# EAGLE design SCHEMATIC_R1 (EAGLE 9.6.2)

## Sheet 1 of 2
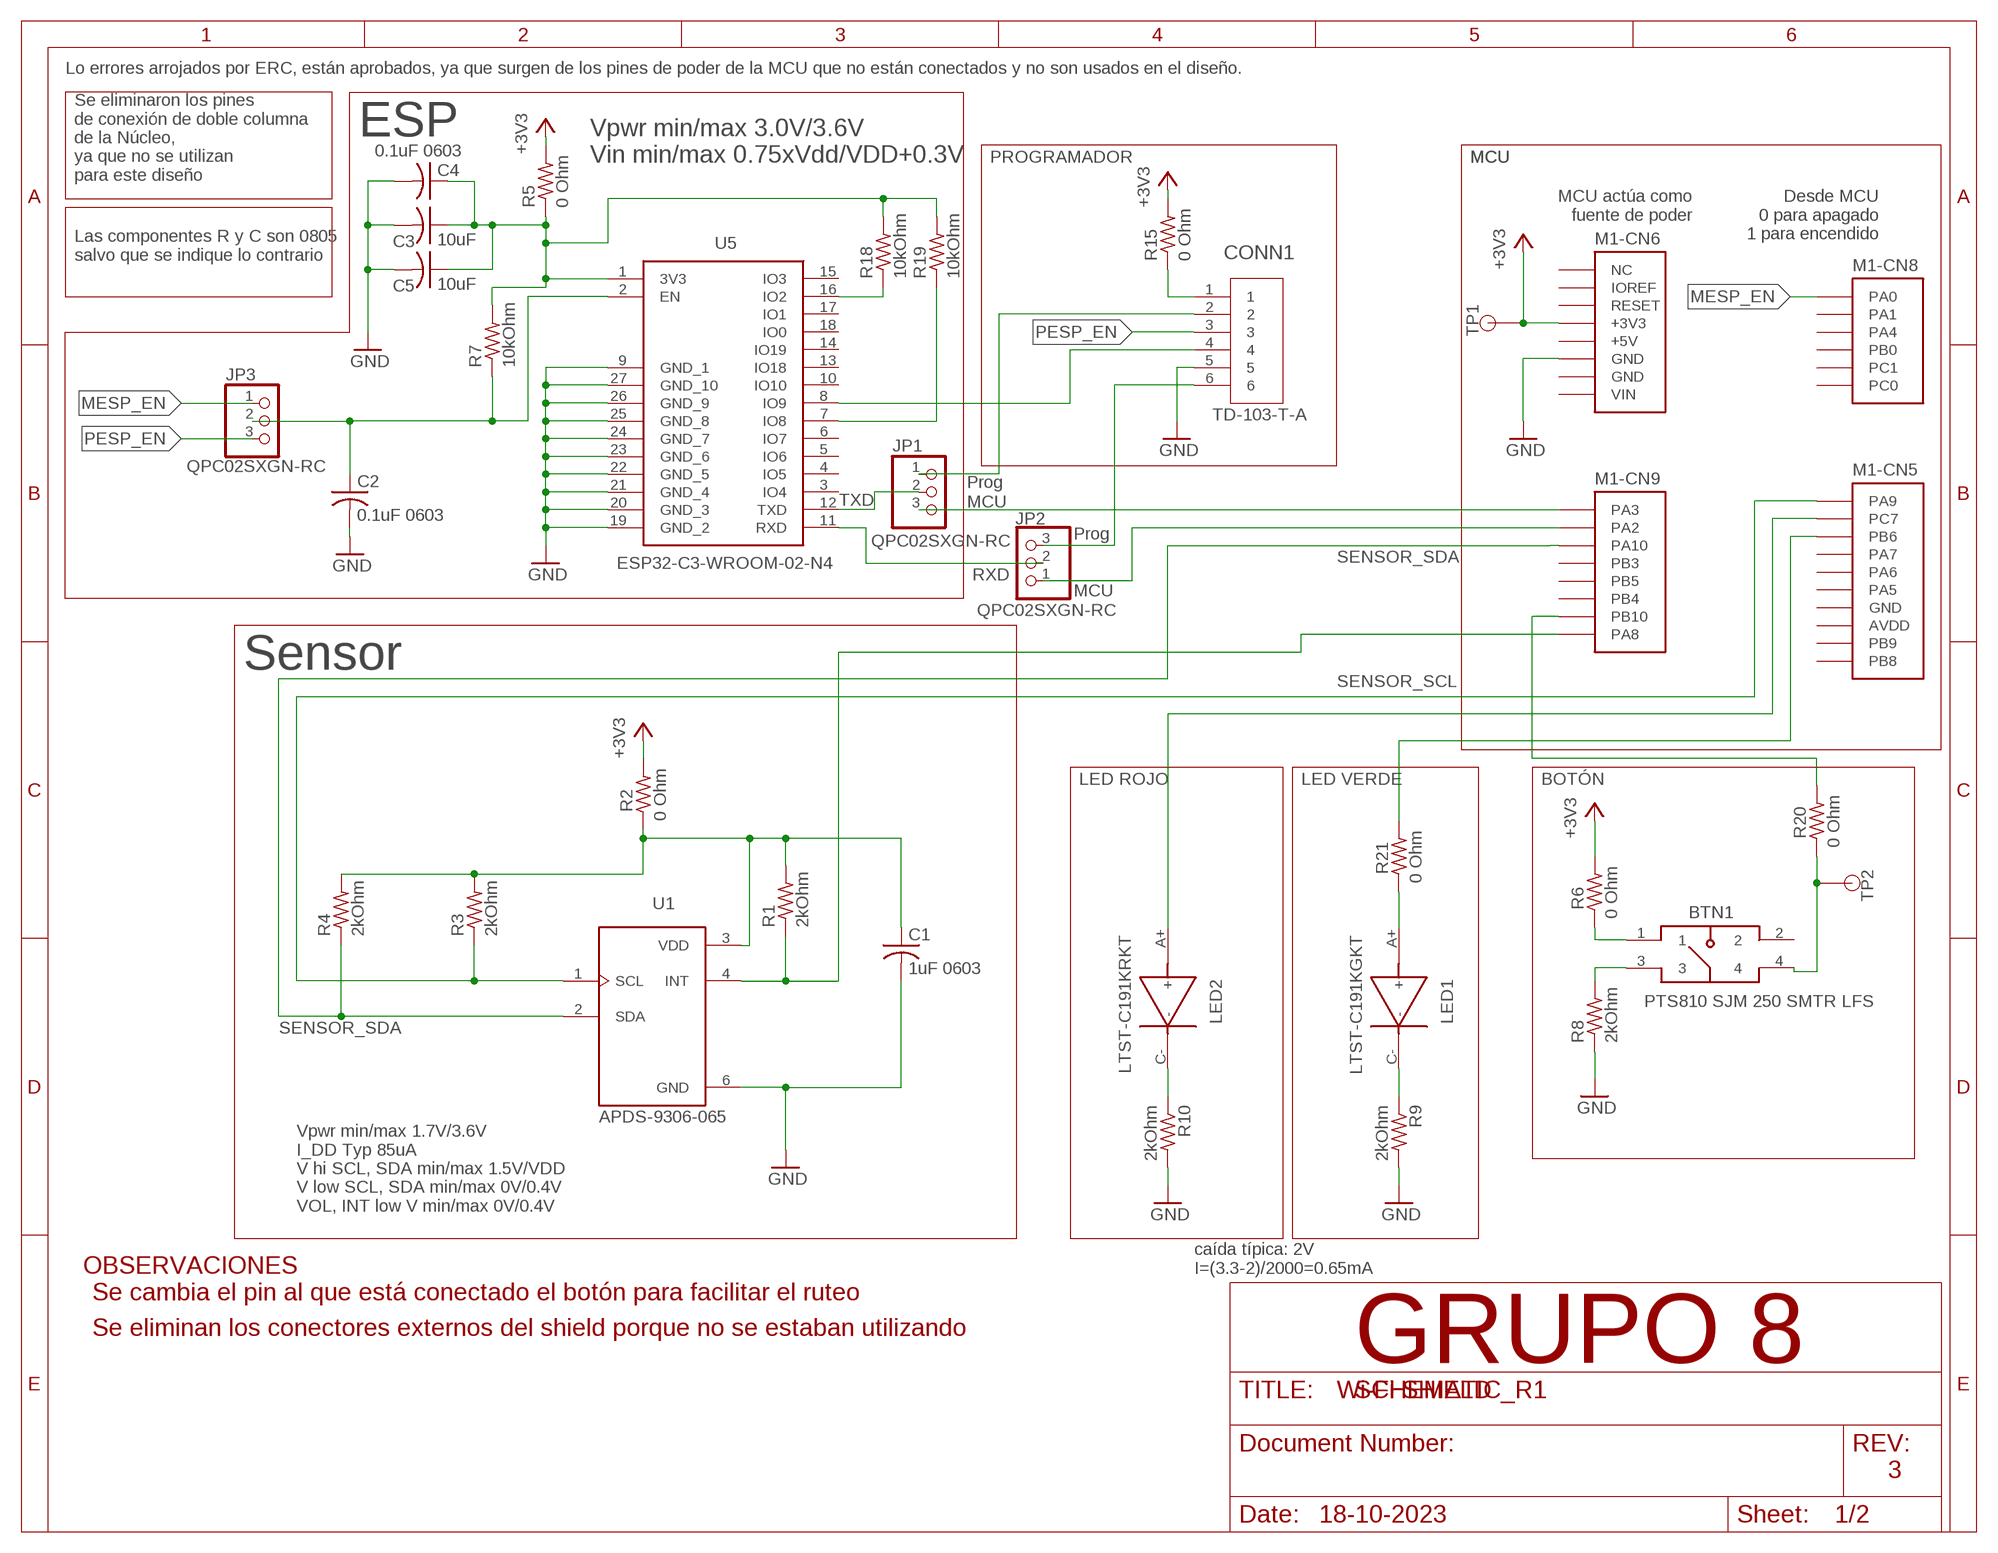
[diagram p0: schematic, sheet 1]

### Parts
BTN1  PTS810 SJM 250 SMTR LFS  PTS810SJM250SMTRLFS  [PTS810]
C1  1uF 0603  C-USC0603  [C0603]
C2  0.1uF 0603  C-USC0603  [C0603]
C3  10uF  C-USC0805  [C0805]
C4  0.1uF 0603  C-USC0603  [C0603]
C5  10uF  C-USC0805  [C0805]
CONN1  TD-103-T-A  TD-103-T-ACON6_2X3_TU_HTS_SAI  [CON6_2X3_TU_HTS_SAI]
JP1  QPC02SXGN-RC  PINHD-1X3  [1X03]
JP2  QPC02SXGN-RC  PINHD-1X3  [1X03]
JP3  QPC02SXGN-RC  PINHD-1X3  [1X03]
LED1  LTST-C191KGKT  LTST-C191KRKT  [0603]
LED2  LTST-C191KRKT  [0603]
M1  NUCLEO-L452RE  [NUCLEO-64]
R1  2kOhm  R-US_M0805  [M0805]
R2  0 Ohm  R-US_M0805  [M0805]
R3  2kOhm  R-US_M0805  [M0805]
R4  2kOhm  R-US_M0805  [M0805]
R5  0 Ohm  R-US_M0805  [M0805]
R6  0 Ohm  R-US_M0805  [M0805]
R7  10kOhm  R-US_R0805  [R0805]
R8  2kOhm  R-US_M0805  [M0805]
R9  2kOhm  R-US_M0805  [M0805]
R10  2kOhm  R-US_M0805  [M0805]
R15  0 Ohm  R-US_M0805  [M0805]
R18  10kOhm  R-US_R0805  [R0805]
R19  10kOhm  R-US_R0805  [R0805]
R20  0 Ohm  R-US_M0805  [M0805]
R21  0 Ohm  R-US_M0805  [M0805]
TP1  TESTPOINT  [TESTPOINT]
TP2  TESTPOINT  [TESTPOINT]
U1  APDS-9306-065  [SON65P200X200X75-6N]
U5  ESP32-C3-WROOM-02-N4  [ESP32C3WROOM02N4]

### Nets
+3V3: M1.CN6-4(-CN6:+3V3) R2.2 R5.2 R6.2 R15.2 TP1.TP
GND: C1.2 C2.2 C3.2 C4.2 C5.2 CONN1.5 M1.CN6-6(-CN6:GND) R8.1 R9.2 R10.2 U1.6(GND) U5.9(GND_1) U5.19(GND_2) U5.20(GND_3) U5.21(GND_4) U5.22(GND_5) U5.23(GND_6) U5.24(GND_7) U5.25(GND_8) U5.26(GND_9) U5.27(GND_10)
MESP_EN: JP3.1 M1.CN8-1(-CN8:PA0)
N$1: M1.CN9-7(-CN9:PB10) R20.2
N$2: C1.1 R1.2 R2.1 R3.2 R4.2 U1.3(VDD)
N$3: M1.CN9-8(-CN9:PA8) R1.1 U1.4(INT)
N$4: LED2.A+(+) M1.CN5-2(-CN5:PC7)
N$5: BTN1.3 R8.2
N$6: R18.1 U5.16(IO2)
N$7: BTN1.1 R6.1
N$8: JP1.3 M1.CN9-1(-CN9:PA3)
N$9: JP2.1 M1.CN9-2(-CN9:PA2)
N$10: BTN1.4 R20.1 TP2.TP
N$11: M1.CN5-3(-CN5:PB6) R21.2
N$12: LED2.C-(-) R10.1
N$14: LED1.C-(-) R9.1
N$15: JP2.2 U5.11(RXD)
N$16: CONN1.2 JP1.1
N$17: CONN1.6 JP2.3
N$18: CONN1.4 U5.8(IO9)
N$19: CONN1.1 R15.1
N$20: R19.1 U5.7(IO8)
N$21: C2.1 JP3.2 R7.1 U5.2(EN)
N$22: C3.1 C4.1 C5.1 R5.1 R7.2 R18.2 R19.2 U5.1(3V3)
N$23: LED1.A+(+) R21.1
N$24: JP1.2 U5.12(TXD)
PESP_EN: CONN1.3 JP3.3
SENSOR_SCL: M1.CN5-1(-CN5:PA9) R3.1 U1.1(SCL)
SENSOR_SDA: M1.CN9-3(-CN9:PA10) R4.1 U1.2(SDA)
Unconnected: BTN1.2 M1.CN5-4(-CN5:PA7) M1.CN5-5(-CN5:PA6) M1.CN5-6(-CN5:PA5) M1.CN5-9(-CN5:PB9) M1.CN5-10(-CN5:PB8) M1.CN6-1(-CN6:NC) M1.CN6-3(-CN6:RESET) M1.CN8-2(-CN8:PA1) M1.CN8-3(-CN8:PA4) M1.CN8-4(-CN8:PB0) M1.CN8-5(-CN8:PC1) M1.CN8-6(-CN8:PC0) M1.CN9-4(-CN9:PB3) M1.CN9-5(-CN9:PB5) M1.CN9-6(-CN9:PB4) U5.3(IO4) U5.4(IO5) U5.5(IO6) U5.6(IO7) U5.10(IO10) U5.13(IO18) U5.14(IO19) U5.15(IO3) U5.17(IO1) U5.18(IO0)

### Notes on the sheet
- Lo errores arrojados por ERC, están aprobados, ya que surgen de los pines de poder de la MCU que no están conectados y no son usados en el diseño.
- ESP
- Vpwr min/max 3.0V/3.6V
  Vin min/max 0.75xVdd/VDD+0.3V
- PROGRAMADOR | MCU | MCU
- Se eliminaron los pines
  de conexión de doble columna
  de la Núcleo,
  ya que no se utilizan
  para este diseño
- MCU actúa como
  fuente de poder
- Desde MCU
  0 para apagado
  1 para encendido
- Las componentes R y C son 0805 
  salvo que se indique lo contrario
- Prog
- TXD | MCU
- Prog
- RXD
- MCU
- Sensor
- LED ROJO | LED VERDE | BOTÓN
- Vpwr min/max 1.7V/3.6V
  I_DD Typ 85uA 
  V hi SCL, SDA min/max 1.5V/VDD
  V low SCL, SDA min/max 0V/0.4V
  VOL, INT low V min/max 0V/0.4V
- OBSERVACIONES
- caída típica: 2V
  I=(3.3-2)/2000=0.65mA
- Se cambia el pin al que está conectado el botón para facilitar el ruteo
- Se eliminan los conectores externos del shield porque no se estaban utilizando
- GRUPO 8
- Wi-Fi SHIELD
- 3
- 18-10-2023

## Sheet 2 of 2
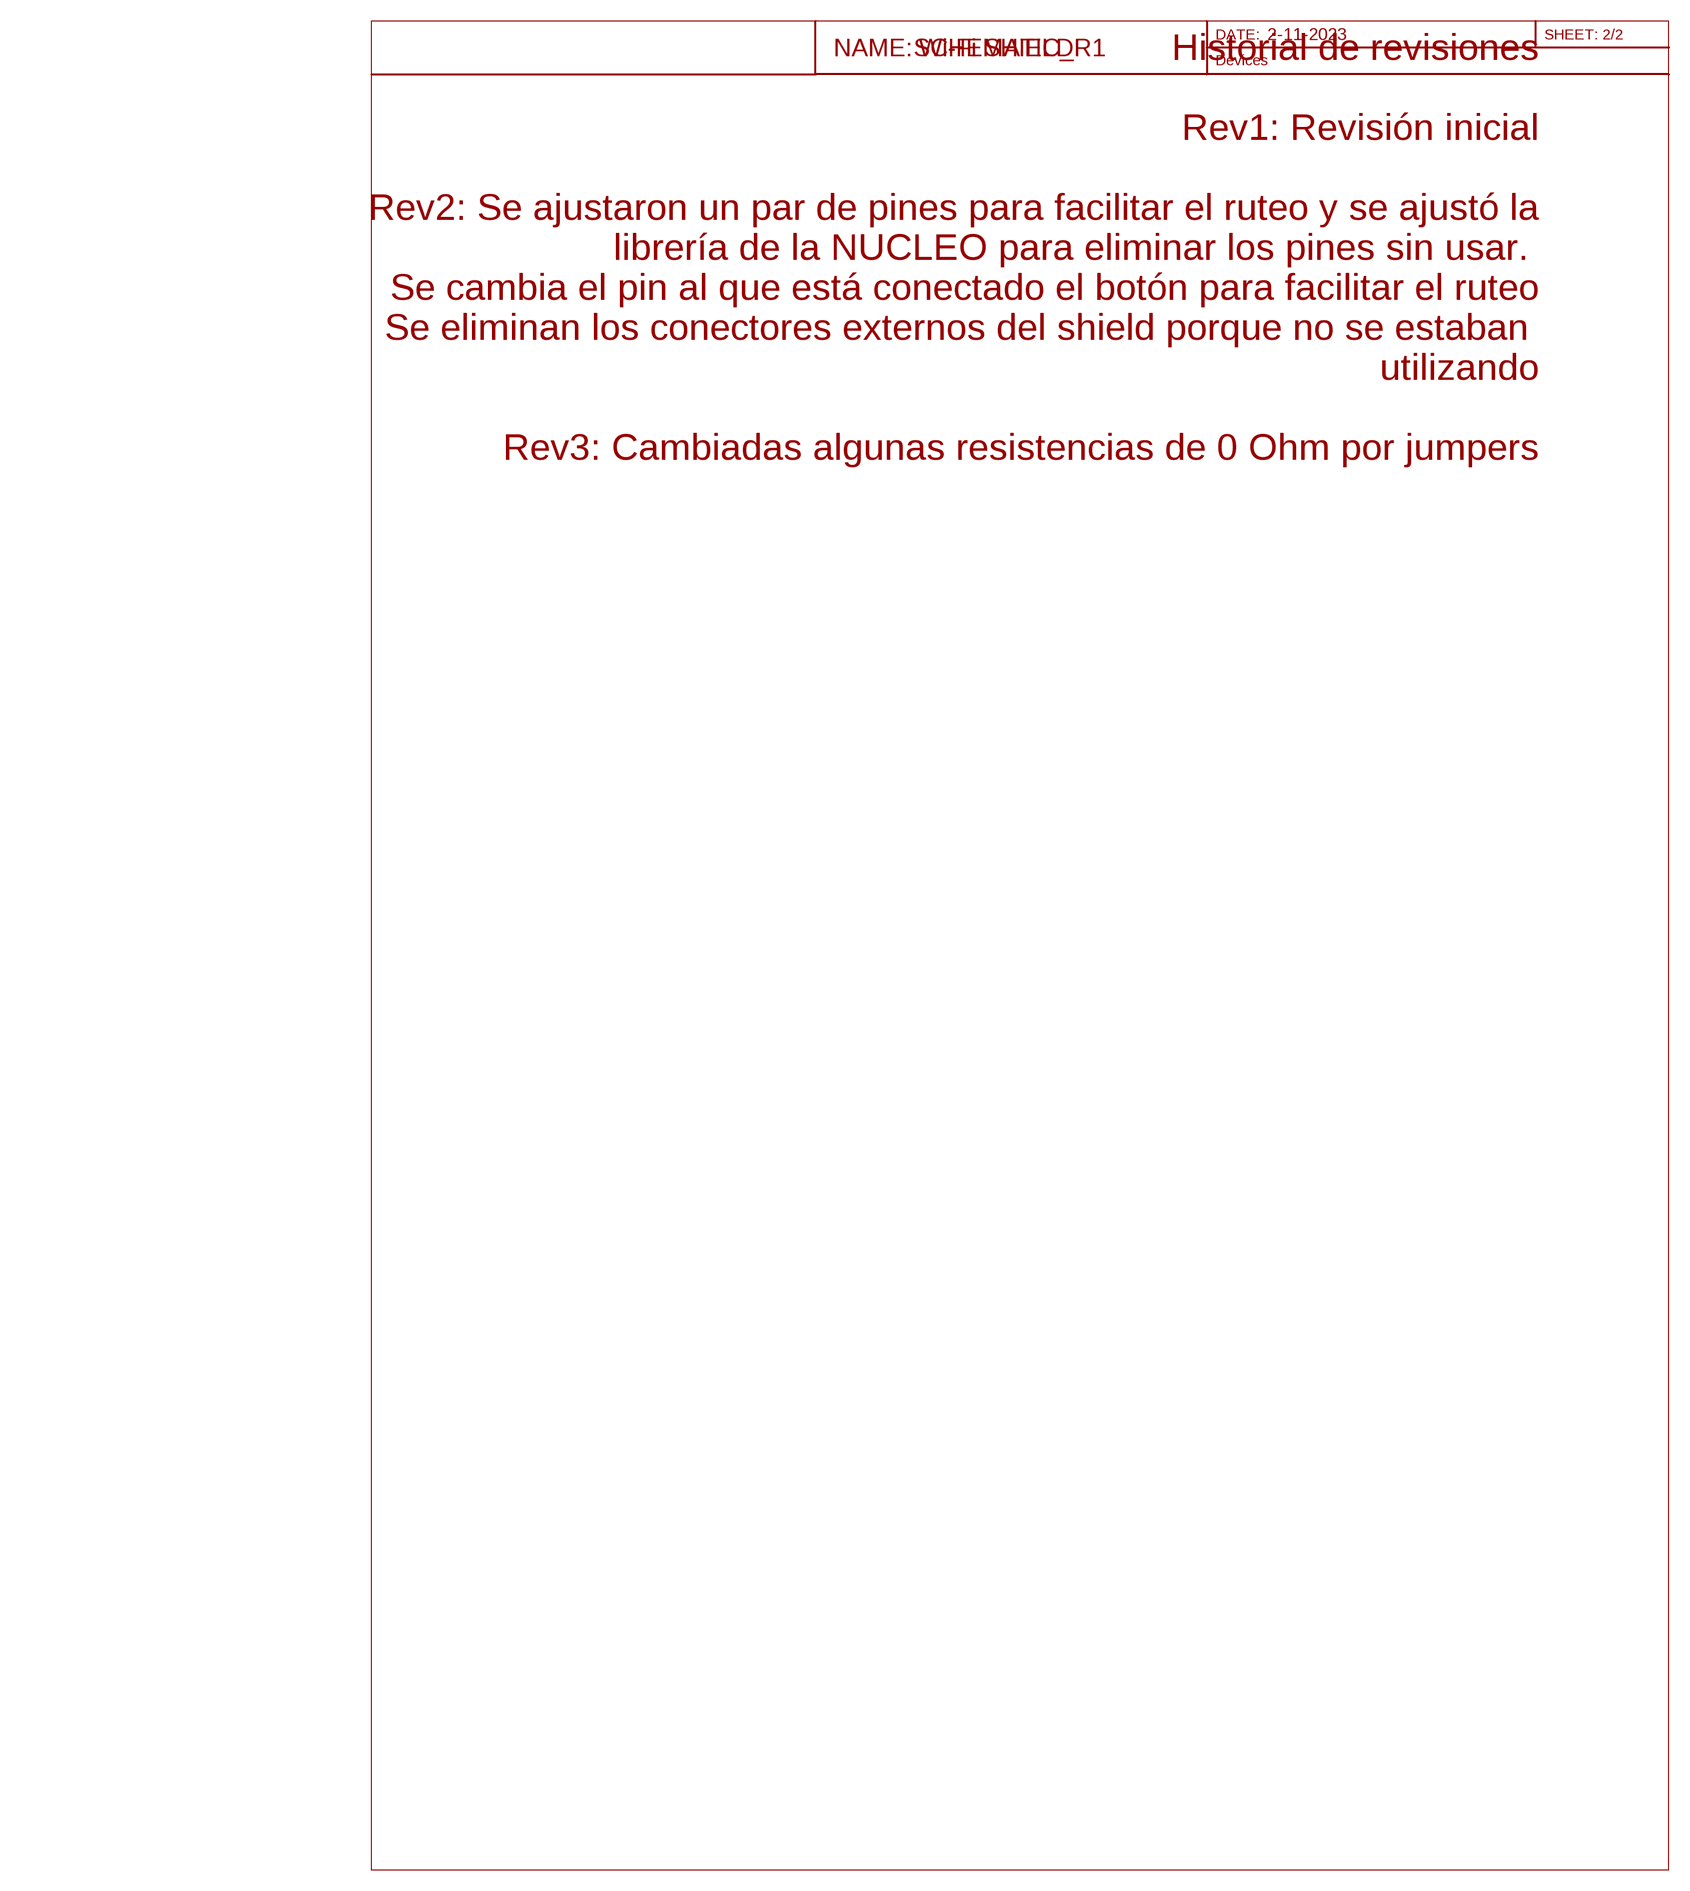
[diagram p1: schematic, sheet 2]

### Notes on the sheet
- Historial de revisiones
  
  Rev1: Revisión inicial
  
  Rev2: Se ajustaron un par de pines para facilitar el ruteo y se ajustó la
  librería de la NUCLEO para eliminar los pines sin usar. 
  Se cambia el pin al que está conectado el botón para facilitar el ruteo
  Se eliminan los conectores externos del shield porque no se estaban 
  utilizando
  
  Rev3: Cambiadas algunas resistencias de 0 Ohm por jumpers
- 2-11-2023
- Wi-Fi SHIELD

## Power pins joined to a net without a drawn wire
+5V: M1.CN6-5(-CN6:+5V)
AVDD: M1.CN5-8(-CN5:AVDD)
GND: M1.CN5-7(-CN5:GND) M1.CN6-7(-CN6:GND)
IOREF: M1.CN6-2(-CN6:IOREF)
VIN: M1.CN6-8(-CN6:VIN)

## Library data of the parts
BTN1 = PTS810_SJM_250_SMTR_LFS-C&K:PTS810SJM250SMTRLFS; PARTNO: PTS810 SJM 250 SMTR LFS
C1 = rcl:C-US: CAPACITOR, American symbol; PARTNO: GCM188R71C105KA64D; SPICEPREFIX: C
C2 C4 = rcl:C-US: CAPACITOR, American symbol; PARTNO: GRM188R72A104KA35D; SPICEPREFIX: C
C3 C5 = rcl:C-US: CAPACITOR, American symbol; PARTNO: GRM21BR71A106KA73L; SPICEPREFIX: C
CONN1 = TD-103-T-A:TD-103-T-A; COPYRIGHT: Copyright (C) 2023 Ultra Librarian. All rights reserved.; MANUFACTURER_PART_NUMBER: TD-103-T-A; MFR_NAME: Samtec Inc; PARTNO: TD-103-T-A
JP1-JP3 = pinhead edit:PINHD-1X3: PIN HEADER; PARTNO: QPC02SXGN-RC
LED1 = LTST-C191KRKT-C&K:LTST-C191KRKT; PARTNO: LTST-C191KGKT
LED2 = LTST-C191KRKT-C&K:LTST-C191KRKT; PARTNO: LTST-C191KRKT
M1 = NUCLEO-L452RE:NUCLEO-L452RE: No existe un outline (Layer Dimension) para esta librería. En su lugar se utilizó una referencia en tDocu. Al momento de diseñar la tarjeta, el Dimension debe ser dibujado según los requerimientos del usuario, o simplemente copiar los contenidos del tDocu en Dimensions.; PARTNO: NUCLEO-L452RE
R1 R3 R4 R8-R10 = rcl:R-US_: RESISTOR, American symbol; PARTNO: RMCF0805FT2K00; SPICEPREFIX: R
R2 R5 R6 R15 R20 R21 = rcl:R-US_: RESISTOR, American symbol; PARTNO: RMCF0805ZT0R00; SPICEPREFIX: R
R7 R18 R19 = rcl:R-US_: RESISTOR, American symbol; PARTNO: RMCF0805JT10K0; SPICEPREFIX: R
TP1 TP2 = TEST_POINT:TESTPOINT
U1 = APDS-9306-065 - Avago Technologies:APDS-9306-065: Digital Ambient Light Photo Sensor with I2C Output; MANUFACTURER: AVAGO TECHNOLOGIES; PARTNO: APDS-9306-065; STANDARD: IPC-7351B
U5 = ESP32-C3-WROOM-02-N4:ESP32-C3-WROOM-02-N4: WiFi Modules (802.11) (Engineering Samples) SMD module, ESP32-C3, 4MB SPI flash, PCB antenna, -40 C +85 C Source: Datasheet <https://www.mouser.ch/datasheet/2/891/Espressif_ESP32_C3_WROOM_02-2006871.pdf>; DESCRIPTION: WiFi Modules (802.11) (Engineering Samples) SMD module, ESP32-C3, 4MB SPI flash, PCB antenna, -40 C +85 C; HEIGHT: 3.35mm; MANUFACTURER_NAME: Espressif Systems; MANUFACTURER_PART_NUMBER: ESP32-C3-WROOM-02-N4; MOUSER_PART_NUMBER: 356-ESP32C3WROOM02N4; MOUSER_PRICE-STOCK: https://www.mouser.co.uk/ProductDetail/Espressif-Systems/ESP32-C3-WROOM-02-N4?qs=stqOd1AaK7%2FqjTZKEOgfUg%3D%3D; PARTNO: ESP32-C3-WROOM-02-N4

## Board
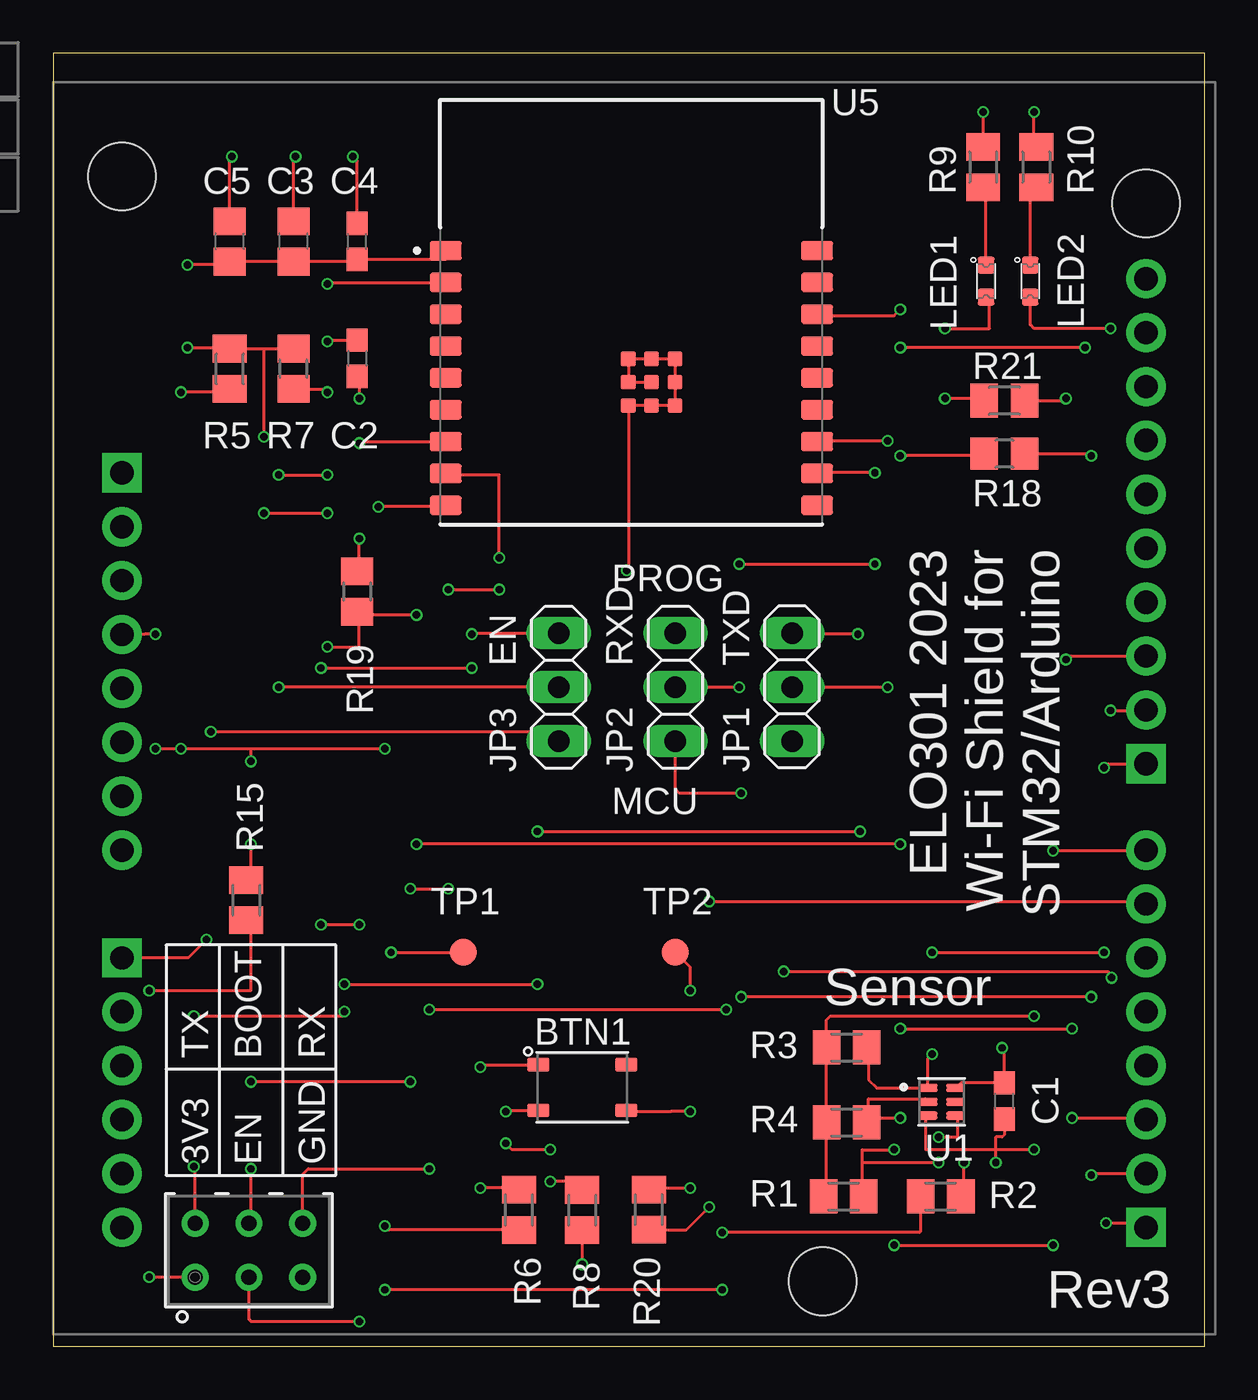
[diagram p2: board, top side]
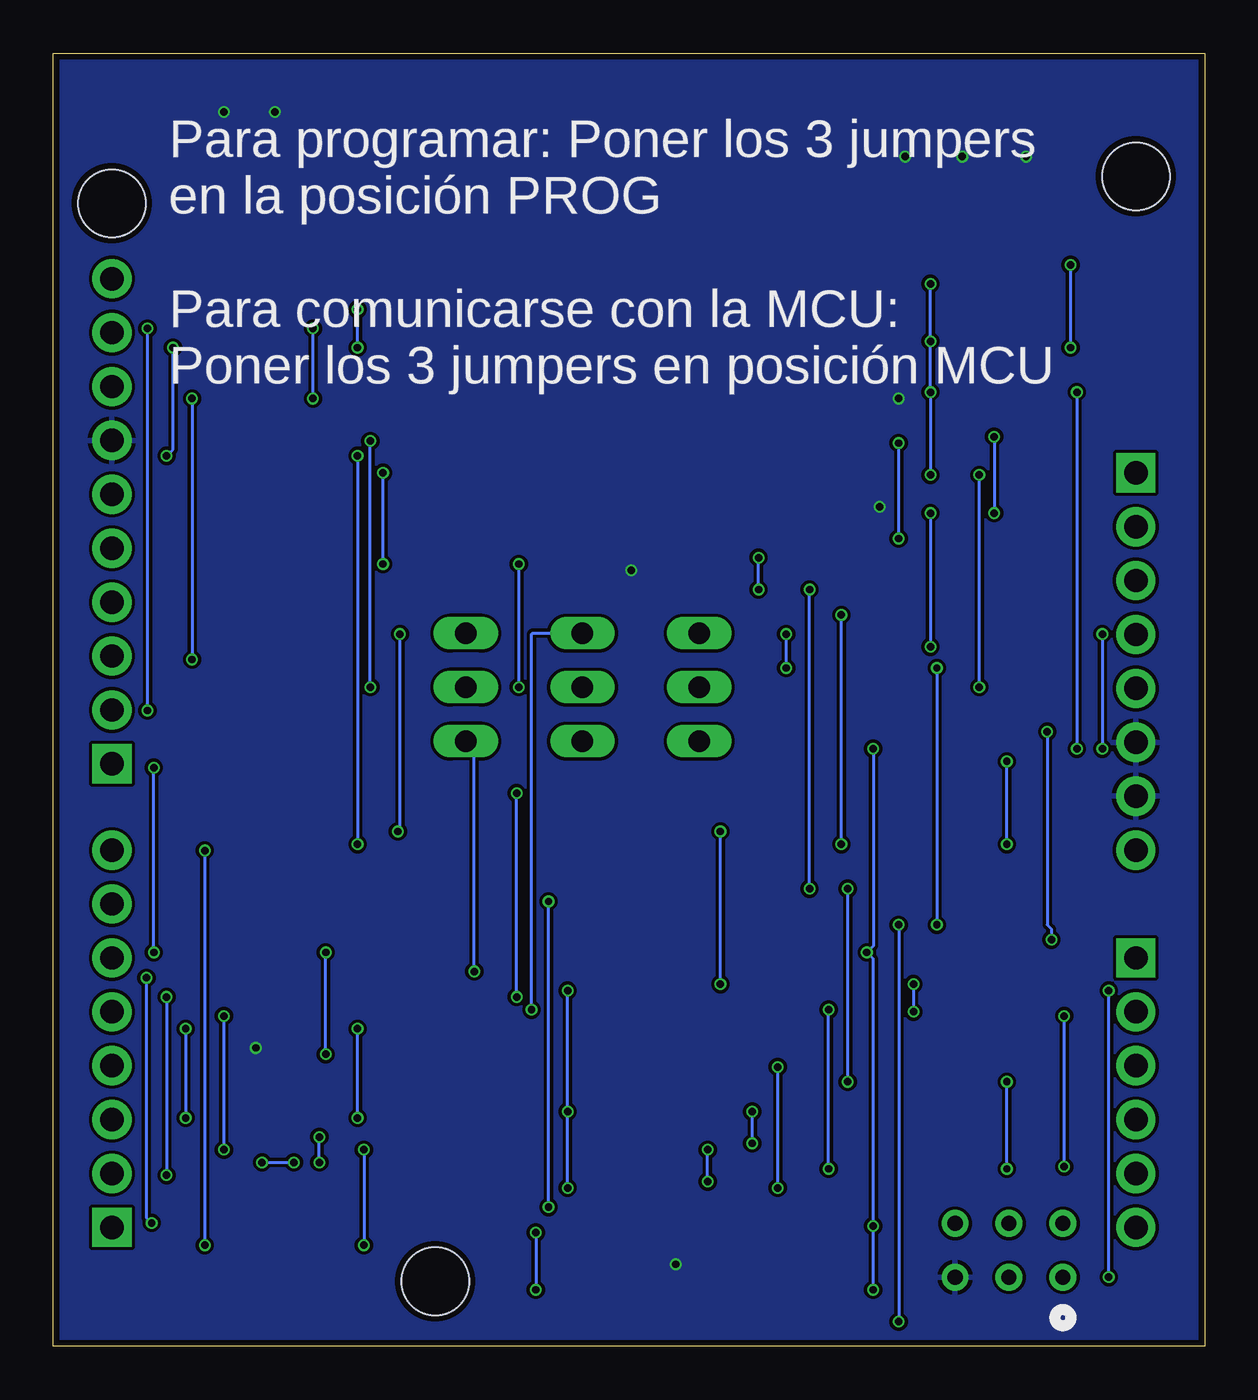
[diagram p3: board, bottom side, seen from below]

Size 54.28 x 60.95 mm. Coordinates in mm from the lower left corner, seen from the top.
Outline: 0,0 54.28,0 54.28,60.95 0,60.95 0,0
Copper layers (1*16): Top 0.035mm / dielectric 1.5mm / Bottom 0.035mm
Design rules "PCBWay_2L_152um-Track *": minimum track width 6mil, minimum drill 0.3mm, track to track 6mil, track to pad 6mil, pad to pad 6mil, via to via 6mil, smd to smd 0mil, copper to edge 0.3mm, drill to drill 10mil, minimum pad ring 6mil, minimum via ring 0.1mm, stop-mask expansion 2mil, vias tented up to drill 0.45mm, thermal gap 0.2mm

### Footprints (pad centres in the part's own frame; a part is rotated, then mirrored left to right if it is on the bottom)
PTS810 = smd 1.05 x 0.65: 1 -2.075,1.075; 2 2.075,1.075; 3 -2.075,-1.075; 4 2.075,-1.075
C0603 = smd 1.1 x 1: 1 -0.85,0; 2 0.85,0
C0805 = smd 1.3 x 1.5: 1 -0.95,0; 2 0.95,0
CON6_2X3_TU_HTS_SAI = drill 0.711 pad 1.27: 1 -2.54,-1.27; 2 -2.54,1.27; 3 0,-1.27; 4 0,1.27; 5 2.54,-1.27; 6 2.54,1.27
1X03 = drill 1.016 long: 1 -2.54,0; 2 0,0; 3 2.54,0
0603 = smd 0.8 x 0.8: A+ -0.75,0; C- 0.75,0
NUCLEO-64 = drill 1.1 pad 1.85 square: CN5-1 59.13,24.884; CN6-1 10.87,38.6; CN8-1 10.87,15.74; CN9-1 59.13,3.04 | drill 1.1 pad 1.85: CN5-2 59.13,27.424; CN5-3 59.13,29.964; CN5-4 59.13,32.504; CN5-5 59.13,35.044; CN5-6 59.13,37.584; CN5-7 59.13,40.124; CN5-8 59.13,42.664; CN5-9 59.13,45.204; CN5-10 59.13,47.744; CN6-2 10.87,36.06; CN6-3 10.87,33.52; CN6-4 10.87,30.98; CN6-5 10.87,28.44; CN6-6 10.87,25.9; CN6-7 10.87,23.36; CN6-8 10.87,20.82; CN8-2 10.87,13.2; CN8-3 10.87,10.66; CN8-4 10.87,8.12; CN8-5 10.87,5.58; CN8-6 10.87,3.04; CN9-2 59.13,5.58; CN9-3 59.13,8.12; CN9-4 59.13,10.66; CN9-5 59.13,13.2; CN9-6 59.13,15.74; CN9-7 59.13,18.28; CN9-8 59.13,20.82 | hole 3.175: 59.13,51.3; 10.87,52.57; 43.89,0.5
M0805 = smd 1.3 x 1.6: 1 -0.95,0; 2 0.95,0
R0805 = smd 1.3 x 1.5: 1 -0.95,0; 2 0.95,0
TESTPOINT = smd 1.27 x 1.27: TP 0,0
SON65P200X200X75-6N = smd 0.9 x 0.4: 1 -0.645,0.65; 2 -0.645,0; 3 -0.645,-0.65; 4 0.655,-0.65; 5 0.655,0; 6 0.655,0.65
ESP32C3WROOM02N4 = smd 1.5 x 0.9: 1 -9.71,6.2; 2 -9.71,4.7; 3 -9.71,3.2; 4 -9.71,1.7; 5 -9.71,0.2; 6 -9.71,-1.3; 7 -9.71,-2.8; 8 -9.71,-4.3; 9 -9.71,-5.8; 10 7.79,-5.8; 11 7.79,-4.3; 12 7.79,-2.8; 13 7.79,-1.3; 14 7.79,0.2; 15 7.79,1.7; 16 7.79,3.2; 17 7.79,4.7; 18 7.79,6.2 | smd 0.7 x 0.7: 19 0,0; 20 1.1,0; 21 1.1,1.1; 22 0,1.1; 23 -1.1,1.1; 24 -1.1,0; 25 -1.1,-1.1; 26 0,-1.1; 27 1.1,-1.1

### Placement (x,y rotation side)
BTN1  24.94,12.2 0 top
C1  44.83,11.57 90 top
C2  14.33,46.57 270 top
C3  11.33,52.07 90 top
C4  14.33,52.07 90 top
C5  8.33,52.07 90 top
CONN1  9.23,4.53 0 top
JP1  34.83,31.07 270 top
JP2  29.33,31.07 90 top
JP3  23.83,31.07 90 top
JP_C1  QPC02SXGN-RC  [PLACEHOLDER]  -4.17,60.17 0 top  (outside the outline)
JP_C2  QPC02SXGN-RC  [PLACEHOLDER]  -4.17,57.47 0 top  (outside the outline)
JP_C3  QPC02SXGN-RC  [PLACEHOLDER]  -4.17,54.77 0 top  (outside the outline)
LED1  43.97,50.2 90 top
LED2  46.05,50.2 90 top
M1  -7.62,2.57 0 top
R1  37.26,7.07 180 top
R2  41.83,7.07 180 top
R3  37.4,14.09 180 top
R4  37.4,10.55 180 top
R5  8.33,46.07 270 top
R6  21.96,6.43 270 top
R7  11.33,46.07 90 top
R8  24.93,6.43 90 top
R9  43.83,55.57 90 top
R10  46.33,55.57 90 top
R15  9.11,21.03 90 top
R18  44.83,42.07 180 top
R19  14.33,35.57 270 top
R20  28.08,6.45 270 top
R21  44.83,44.57 0 top
TP1  19.33,18.57 0 top
TP2  29.33,18.57 0 top
U1  41.88,11.53 0 top
U5  28.21,45.44 0 top

### Tracks (layer width: path | path; a pad name or v marks a point on that pad's centre or on a via)
+3V3  (via drill 0.35)
  Top 0.152: R5.2 8.18,44.97 v6.03,44.97 | 9.33,28.17 v6.03,28.17 v4.83,28.17 | 9.33,28.17 v15.63,28.17 | v15.93,18.57 TP1.TP | R6.2 15.81,5.48 v15.63,5.67 | R2.2 40.88,5.42 40.83,5.37 v31.53,5.37 | v31.53,2.67 v15.63,2.67 | R15.2 9.33,22.2 v9.33,23.67 | v9.33,27.57 9.33,28.17 | v4.83,33.57 4.33,33.57 4.31,33.55 M1.CN6-4
  Bottom 0.152: v6.03,44.97 v6.03,28.17 | v15.63,28.17 15.63,18.87 v15.93,18.57 15.63,18.27 v15.63,5.67 v15.63,2.67 | v31.53,5.37 v31.53,2.67 | v4.83,33.57 v4.83,28.17 | v9.33,23.67 v9.33,27.57
GND  (via drill 0.35)
  Top 0.152: C3.2 11.33,55.97 v11.43,56.07 | C4.2 14.33,55.87 v14.13,56.07 | C5.2 8.33,55.97 v8.43,56.07 | U5.9 18.43,39.57 v15.33,39.57 | C2.2 14.43,45.62 v14.43,44.67 | U5.19 U5.24 U5.23 U5.22 U5.21 U5.20 U5.27 U5.26 U5.25 27.11,36.65 v27.03,36.57 | R9.2 v43.83,58.17 | R10.2 46.23,56.62 v46.23,58.17 | R8.1 v24.93,3.87 | v44.73,14.07 44.83,13.97 C1.2 42.77,12.42 U1.6
  pour Bottom: 0.03,60.87 0.03,-0.03 54.33,-0.03 54.33,60.87
MESP_EN  (via drill 0.35)
  Top 0.152: v7.23,19.17 6.37,18.31 M1.CN8-1 | v7.43,28.97 23.39,28.97 JP3.1
  Bottom 0.152: v7.43,28.97 7.43,19.87 7.23,19.67 v7.23,19.17
N$1  (via drill 0.35)
  Top 0.152: R20.2 29.86,5.5 v30.93,6.57 | v30.93,20.97 50.18,20.97 50.73,20.97 51.39,20.97 M1.CN9-7
  Bottom 0.152: v30.93,6.57 v30.93,20.97
N$2  (via drill 0.35)
  Top 0.152: R1.2 36.45,7.21 R4.2 R3.2 36.45,15.39 36.63,15.57 v46.23,15.57 | C1.1 44.83,9.97 44.73,9.87 44.43,9.87 44.43,9.27 | 44.43,9.27 41.13,9.27 41.13,10.77 U1.3 | R2.1 42.93,7.22 v42.93,8.67 | v44.43,8.67 44.43,9.27 | v46.23,9.27 44.43,9.27
  Bottom 0.152: v44.43,8.67 v42.93,8.67 | v46.23,15.57 v46.23,9.27
N$3  (via drill 0.35)
  Top 0.152: R1.1 38.13,7.15 38.13,8.67 | 38.13,8.67 v41.73,8.67 | v41.73,9.87 42.63,9.87 42.63,10.79 U1.4 | 38.13,8.67 38.13,9.27 v39.63,9.27 | v39.63,4.77 v47.13,4.77 | v47.13,23.37 51.49,23.37 M1.CN9-8
  Bottom 0.152: v41.73,8.67 v41.73,9.87 | v39.63,9.27 v39.63,4.77 | v47.13,23.37 v47.13,4.77
N$4  (via drill 0.35)
  Top 0.152: v49.83,47.97 46.23,47.97 46.05,48.15 LED2.A+ | v49.83,29.97 51.49,29.97 M1.CN5-2
  Bottom 0.152: v49.83,29.97 v49.83,47.97
N$5  (via drill 0.35)
  Top 0.152: R8.2 24.54,7.77 v23.43,7.77 | v23.43,9.27 21.63,9.27 v21.33,9.57 | v21.33,11.07 21.38,11.12 BTN1.3
  Bottom 0.152: v23.43,7.77 v23.43,9.27 | v21.33,9.57 v21.33,11.07
N$6  (via drill 0.35)
  Top 0.152: R18.1 48.83,42.07 v48.93,41.97 | v48.63,47.07 v39.93,47.07 | v39.93,48.87 39.63,48.57 36.63,48.57 36.56,48.64 U5.16
  Bottom 0.152: v48.93,41.97 48.63,42.27 v48.63,47.07 | v39.93,47.07 v39.93,48.87
N$7  (via drill 0.35)
  Top 0.152: R6.1 21.87,7.47 v20.13,7.47 | v20.13,13.17 20.23,13.27 BTN1.1
  Bottom 0.152: v20.13,7.47 v20.13,13.17
N$8  (via drill 0.35)
  Top 0.152: v34.43,17.67 49.73,17.67 49.88,17.52 v49.88,17.37 | v49.63,5.82 51.3,5.82 M1.CN9-1
  Bottom 0.152: v49.88,17.37 49.88,6.07 v49.63,5.82 | v34.43,17.67 34.43,28.13 JP1.3
N$9  (via drill 0.35)
  Top 0.152: v48.93,16.47 v32.43,16.47 | M1.CN9-2 49.01,8.15 v48.93,8.07 | v32.43,26.07 29.53,26.07 29.33,26.27 JP2.1
  Bottom 0.152: v48.93,16.47 v48.93,8.07 | v32.43,16.47 v32.43,26.07
N$10  (via drill 0.35)
  Top 0.152: R20.1 28.15,7.47 v30.03,7.47 | v30.03,11.07 29.13,11.07 27.07,11.07 BTN1.4 | v30.03,16.77 30.03,17.87 TP2.TP
  Bottom 0.152: v30.03,7.47 v30.03,11.07 v30.03,16.77
N$11  (via drill 0.35)
  Top 0.152: R21.2 47.63,44.57 v47.73,44.67 | M1.CN5-3 47.89,32.53 v47.73,32.37
  Bottom 0.152: v47.73,44.67 v47.73,32.37
N$12
  Top 0.152: LED2.C- 46.05,54.34 R10.1
N$14
  Top 0.152: LED1.C- 43.97,54.48 R9.1
N$15  (via drill 0.35)
  Top 0.152: JP2.2 v32.33,31.07 | v32.33,36.87 v38.73,36.87 | v38.73,41.17 36.03,41.17 U5.11
  Bottom 0.152: v32.33,31.07 v32.33,36.87 | v38.73,36.87 v38.73,41.17
N$16  (via drill 0.35)
  Top 0.152: CONN1.2 6.69,8.41 v6.63,8.47 | v6.63,15.57 13.73,15.57 v13.73,15.77 | v13.73,17.07 v22.83,17.07 | v22.83,24.27 v38.03,24.27 | v37.93,33.57 34.87,33.57 JP1.1
  Bottom 0.152: v6.63,8.47 v6.63,15.57 | v13.73,17.07 v13.73,15.77 | v22.83,17.07 v22.83,24.27 | v38.03,24.27 37.93,24.37 v37.93,33.57
N$17  (via drill 0.35)
  Top 0.152: CONN1.6 11.77,8.11 12.03,8.37 v17.73,8.37 | v31.73,15.87 v17.73,15.87
  Bottom 0.152: v17.73,8.37 v17.73,15.87 | v31.73,15.87 31.73,33.57 31.69,33.61 JP2.3
N$18  (via drill 0.35)
  Top 0.152: CONN1.4 9.33,5.9 v9.33,8.37 | v16.83,12.47 v9.33,12.47 | v16.83,21.57 v18.63,21.57 | v18.63,35.67 v21.03,35.67 | v21.03,37.17 21.03,41.07 18.57,41.07 U5.8
  Bottom 0.152: v9.33,8.37 v9.33,12.47 | v16.83,12.47 v16.83,21.57 | v18.63,21.57 v18.63,35.67 | v21.03,35.67 v21.03,37.17
N$19  (via drill 0.35)
  Top 0.152: CONN1.1 v4.54,3.26 v4.53,3.27 | v4.53,16.77 9.33,16.77 9.33,19.86 R15.1
  Bottom 0.152: v4.53,3.27 v4.53,16.77
N$20  (via drill 0.35)
  Top 0.152: R19.1 14.43,36.62 v14.43,38.07 | v14.43,42.57 14.5,42.64 U5.7
  Bottom 0.152: v14.43,38.07 v14.43,42.57
N$21  (via drill 0.35)
  Top 0.152: R7.1 12.78,45.12 v12.93,44.97 | v12.93,47.37 12.98,47.42 C2.1 | v12.93,50.07 13,50.14 U5.2 | JP3.2 v10.63,31.07 | v10.63,41.07 v12.93,41.07
  Bottom 0.152: v12.93,50.07 v12.93,47.37 v12.93,44.97 v12.93,41.07 | v10.63,31.07 v10.63,41.07
N$22  (via drill 0.35)
  Top 0.152: U5.1 18.5,51.22 C4.1 14.23,51.12 C3.1 C5.1 8.18,50.97 v6.33,50.97 | v6.33,47.07 8.28,47.07 R5.1 9.93,47.02 | 9.93,47.02 R7.2 | 9.93,47.02 v9.93,42.87 | v9.93,39.27 v12.93,39.27 | v12.93,32.97 14.43,32.97 14.43,34.52 | 14.43,34.52 R19.2 | R18.2 43.78,41.97 v39.93,41.97 | v39.93,23.67 v17.13,23.67 | v17.13,34.47 14.48,34.47 14.43,34.52
  Bottom 0.152: v6.33,50.97 v6.33,47.07 | v9.93,42.87 v9.93,39.27 | v12.93,39.27 v12.93,32.97 | v39.93,41.97 v39.93,23.67 | v17.13,23.67 v17.13,34.47
N$23  (via drill 0.35)
  Top 0.152: R21.1 43.78,44.67 v42.03,44.67 | v42.03,47.97 44.13,47.97 44.13,49.29 LED1.A+
  Bottom 0.152: v42.03,44.67 v42.03,47.97
N$24  (via drill 0.35)
  Top 0.152: JP1.2 v39.33,31.07 | v39.33,42.67 36.03,42.67 U5.12
  Bottom 0.152: v39.33,31.07 v39.33,42.67
PESP_EN  (via drill 0.35)
  Top 0.152: v14.43,19.87 v12.63,19.87 | v14.43,1.17 9.33,1.17 9.23,1.27 CONN1.3 | v12.63,31.97 v19.73,31.97 | v19.73,33.57 19.77,33.61 JP3.3
  Bottom 0.152: v12.63,31.97 v12.63,19.87 | v14.43,19.87 v14.43,1.17 | v19.73,31.97 v19.73,33.57
SENSOR_SCL  (via drill 0.35)
  Top 0.152: R3.1 38.43,14.01 38.43,12.57 38.82,12.18 U1.1 41.23,13.57 v41.43,13.77 | v41.43,18.57 v49.53,18.57 | M1.CN5-1 49.71,27.45 v49.53,27.27
  Bottom 0.152: v41.43,13.77 v41.43,18.57 | v49.53,18.57 v49.53,27.27
SENSOR_SDA  (via drill 0.35)
  Top 0.152: U1.2 41.09,11.67 38.43,11.67 38.43,10.63 R4.1 38.57,10.77 v39.93,10.77 | v39.93,14.97 v48.03,14.97 | v48.03,10.77 51.43,10.77 M1.CN9-3
  Bottom 0.152: v39.93,10.77 v39.93,14.97 | v48.03,14.97 v48.03,10.77

### Text on the board
tPlace: ELO301 2023 / Wi-Fi Shield for / STM32/Arduino | PROG | EN | RXD | TXD | MCU | Sensor | TX | BOOT | RX | 3V3 | EN | GND | Rev3
bPlace: Para programar: Poner los 3 jumpers / en la posición PROG / / Para comunicarse con la MCU: / Poner los 3 jumpers en posición MCU